# Altium schematic sheet 13_16.SchDoc
size A4
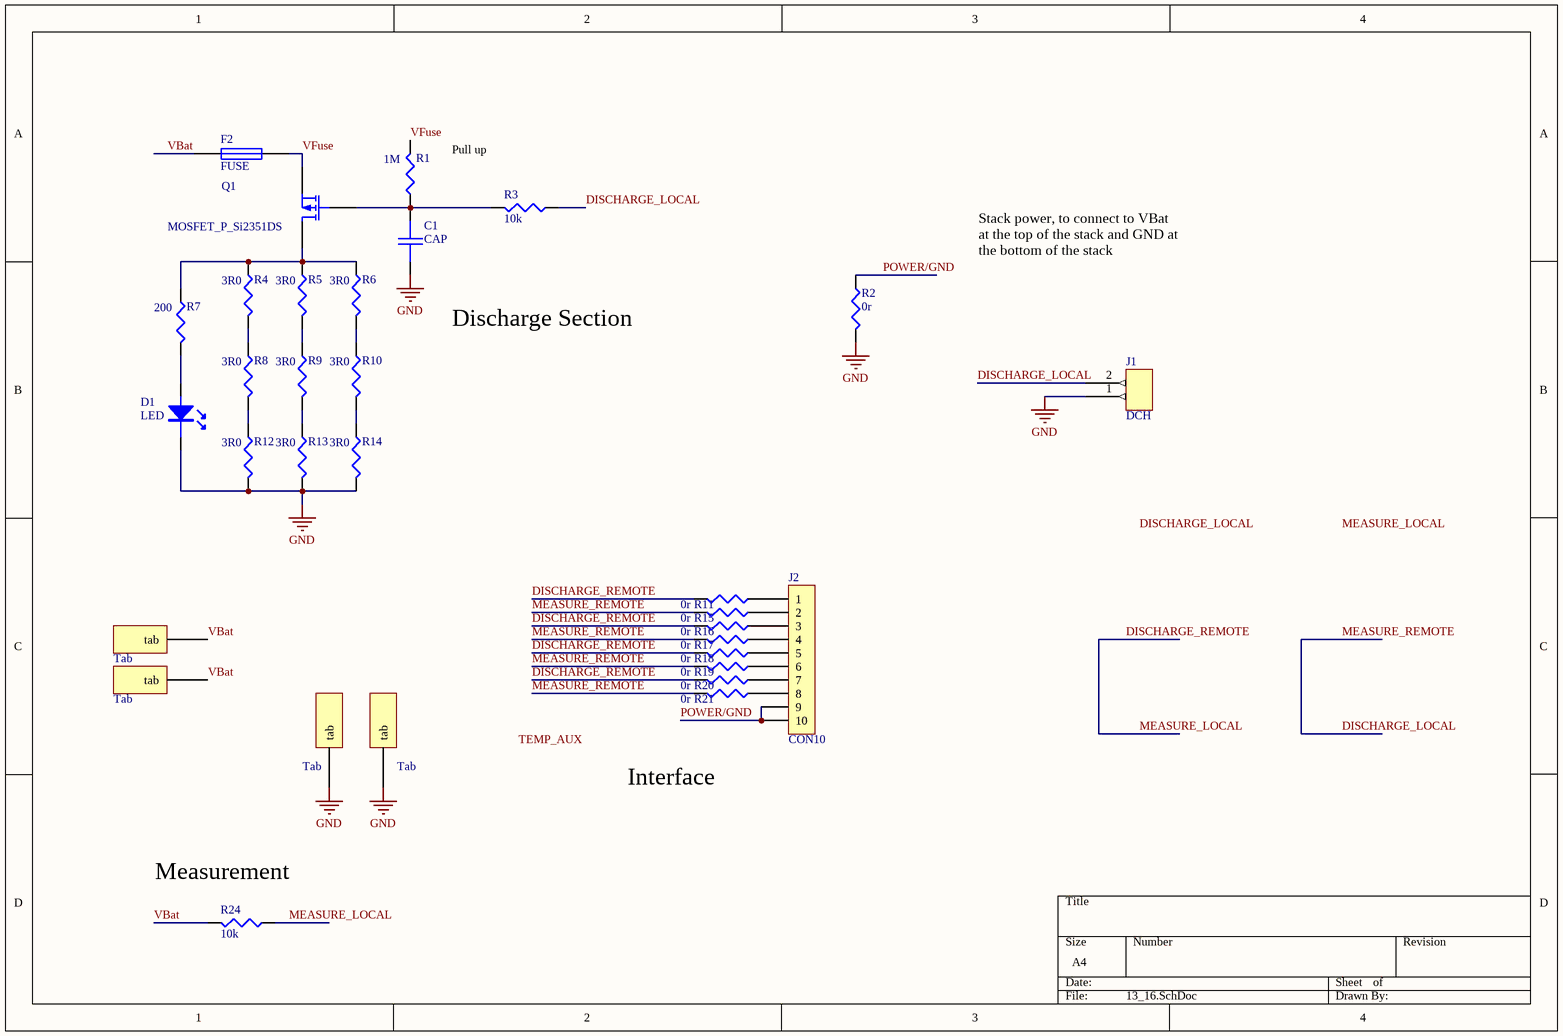
[diagram p0: 13_16.SchDoc]

## Parts
C1  CAP  [0603]
D1  LED  [0805LED]
F2  FUSE  [LITTELFUSE-154]
J1  DCH  [IDC2]
J2  CON10  [IDC10]
J4  Tab  [tab_connect]
J5  Tab  [tab_connect]
J6  Tab  [tab_connect]
J7  Tab  [tab_connect]
Q1  MOSFET_P_Si2351DS  [SOT23-3]
R1  Resistance: 1M  [0603]
R2  Resistance: 0r  [1206]
R3  Resistance: 10k  [0603]
R4  value 3R0  [2512]
R5  value 3R0  [2512]
R6  value 3R0  [2512]
R7  value 200  [0603]
R8  value 3R0  [2512]
R9  value 3R0  [2512]
R10  value 3R0  [2512]
R11  Resistance: 0r  [0603]
R12  value 3R0  [2512]
R13  value 3R0  [2512]
R14  value 3R0  [2512]
R15  Resistance: 0r  [0603]
R16  Resistance: 0r  [0603]
R17  Resistance: 0r  [0603]
R18  Resistance: 0r  [0603]
R19  Resistance: 0r  [0603]
R20  Resistance: 0r  [0603]
R21  Resistance: 0r  [0603]
R24  Resistance: 10k  [0603]

## Nets
GND: C1.2 D1.K J1.1 J6.0(tab) J7.0(tab) R2.2 R12.2 R13.2 R14.2
DISCHARGE_LOCAL: J1.2 R3.1 R15.2 R17.2 R19.2 R21.2  [also labelled MEASURE_REMOTE]
DISCHARGE_REMOTE: R11.2 R16.2 R18.2 R20.2 R24.1  [also labelled MEASURE_LOCAL]
POWER/GND: J2.9 J2.10 R2.1
VBat: F2.1 J4.0(tab) J5.0(tab) R24.2
VFuse: F2.2 Q1.2(S) R1.2
NetC1_1: C1.1 Q1.1(G) R1.1 R3.2
NetD1_A: D1.A R7.2
NetJ2_1: J2.1 R11.1
NetJ2_2: J2.2 R15.1
NetJ2_3: J2.3 R16.1
NetJ2_4: J2.4 R17.1
NetJ2_5: J2.5 R18.1
NetJ2_6: J2.6 R19.1
NetJ2_7: J2.7 R20.1
NetJ2_8: J2.8 R21.1
NetQ1_3: Q1.3(D) R4.1 R5.1 R6.1 R7.1
NetR4_2: R4.2 R8.1
NetR5_2: R5.2 R9.1
NetR6_2: R6.2 R10.1
NetR8_2: R8.2 R12.1
NetR9_2: R9.2 R13.1
NetR10_2: R10.2 R14.1

## Notes on the sheet
- Pull up
- Stack power, to connect to VBat at the top of the stack and GND at the bottom of the stack
- Discharge Section
- (near J2) Interface
- (near R24) Measurement
- Labels drawn without touching a wire or pin: DISCHARGE_LOCAL, MEASURE_LOCAL, TEMP_AUX

## Library data of the parts
C1 = CAP: Capacitor; Value: 100nF
J1 = CON2
J2 = CON10: 10 pin, right angle, ribbon con with claws; RS: 120-8182; Price: 5.46
J4-J7 = tab_connection
Q1 = MOSFET_P_Si2351DS: Si2351DS P-Channel MOSFET; Published: 8-Jun-2000; LatestRevisionDate: 17-Jul-2002; LatestRevisionNote: Re-released for DXP Platform.; PackageVersion: 1995/1996; PackageReference: E3; Publisher: Altium Limited; PackageDescription: TO, Flat Index; 3 In-Line, Axial Leads; Body Dia. 4.6mm; Lead Dia. 0.5 mm (max)
R1-R21 R24 = RES1: Resistor